# EAGLE design changer (EAGLE 8.4.1)
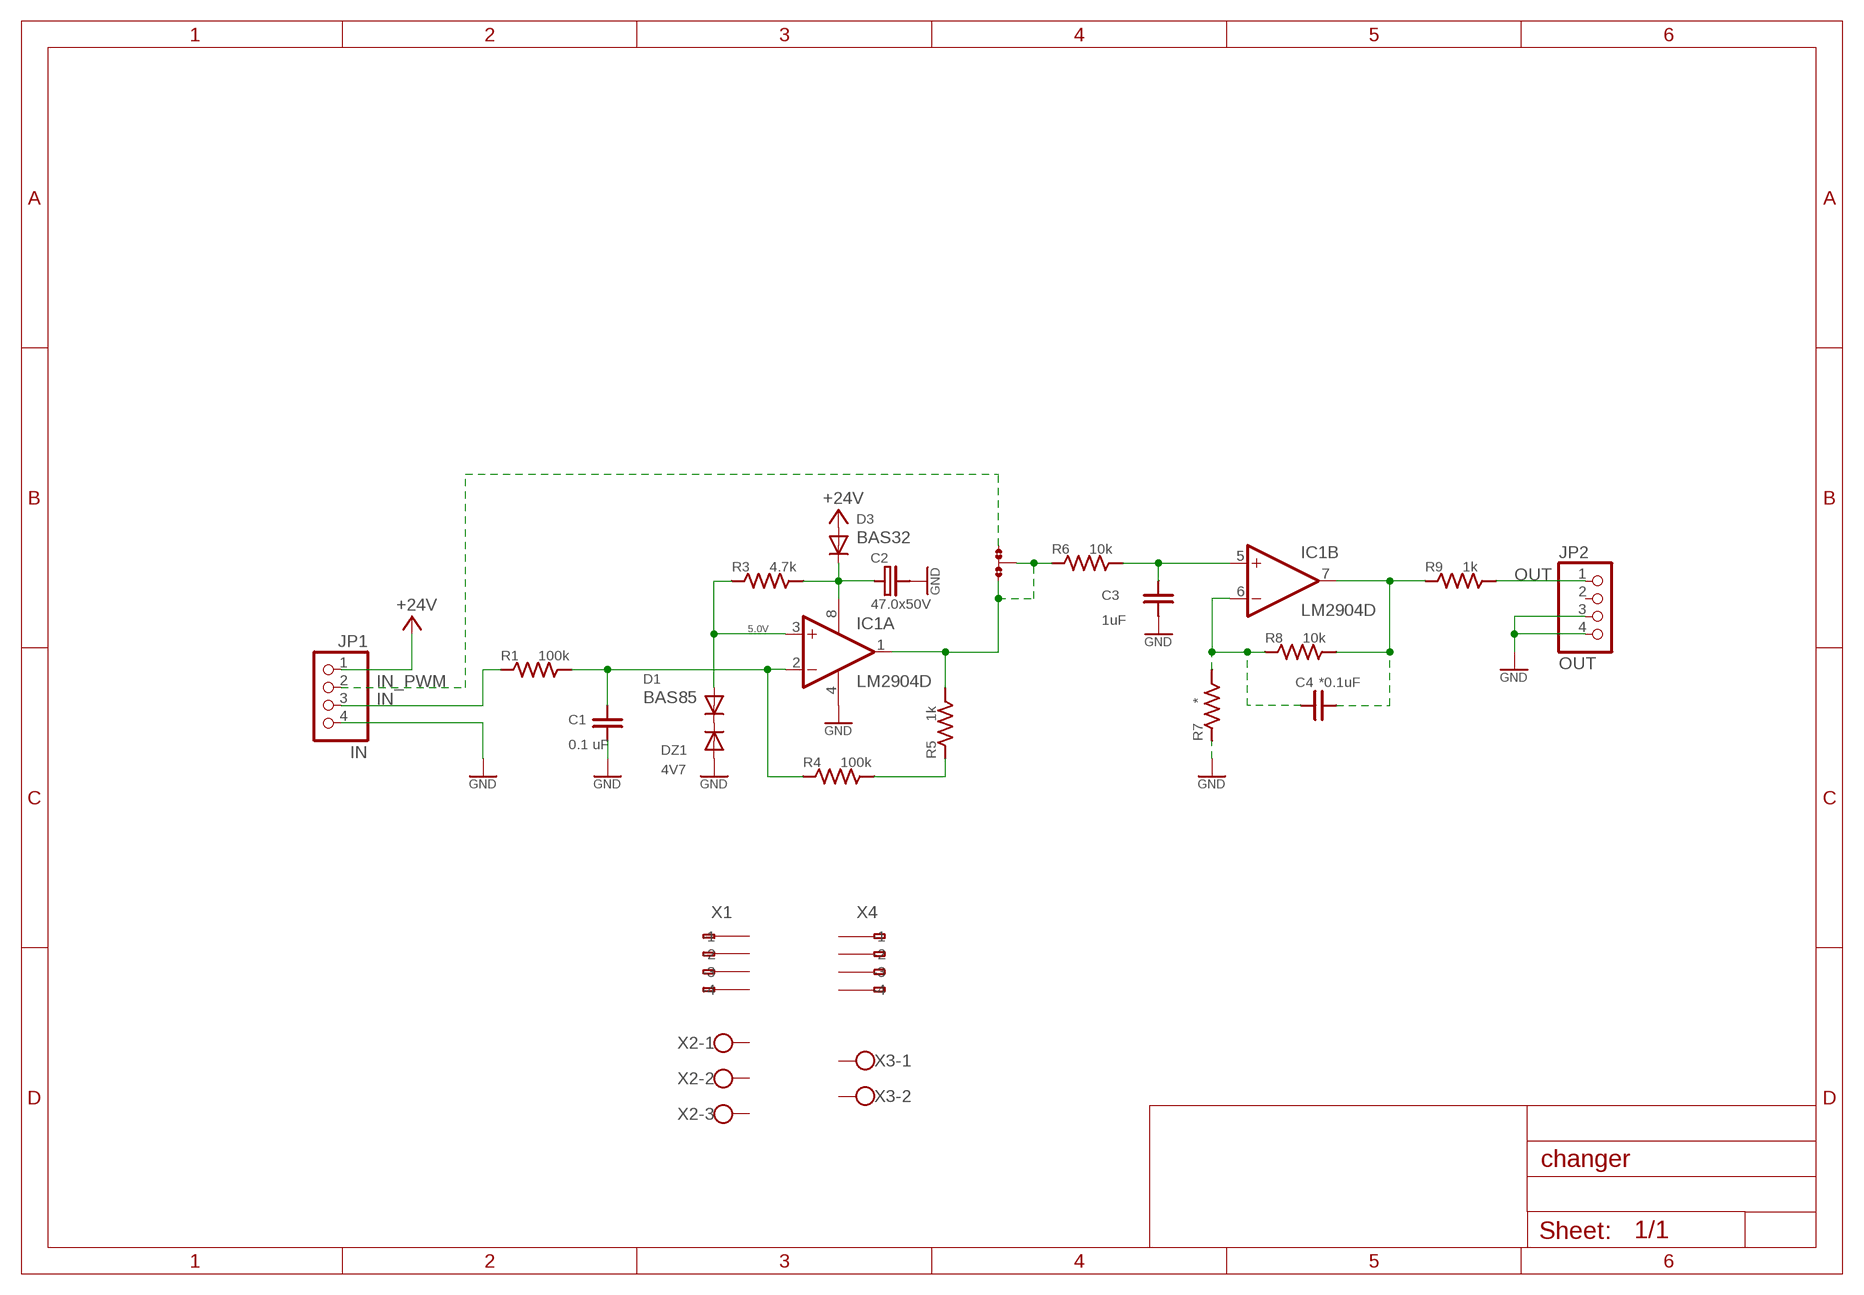
[diagram p0: schematic, sheet 1]

## Parts
C1  0.1 uF  C/0805  [C0805]
C2  47.0x50V  CPOL/E2,5-5  [E2,5-5]
C3  1uF  C/0805  [C0805]
C4  *0.1uF  C/0805  [C0805]
D1  BAS85  DIODE-MINIMELF  [MINIMELF]
D3  BAS32  DIODE-MINIMELF  [MINIMELF]
DZ1  4V7  DIODE-MINIMELF  [MINIMELF]
IC1  LM2904D  LM2903D  [SO08]
JMP1  JUMP  0R-JUMPA  [A0R-JMP]
JP1  IN  PINHD-1X4  [1X04]
JP2  OUT  PINHD-1X4  [1X04]
R1  100k  R/0805  [R0805]
R3  4.7k  R/0805  [R0805]
R4  100k  R/0805  [R0805]
R5  1k  R/0805  [R0805]
R6  10k  R/0805  [R0805]
R7  *  R/0805  [R0805]
R8  10k  R/0805  [R0805]
R9  1k  R/0805  [R0805]
X1  233-104  [233-104]
X2  W237-103  [W237-103]
X3  W237-102  [W237-102]
X4  233-104  [233-104]

## Nets
+24V [power]: D3.A JP1.1
GND: C1.1 C2.- C3.1 DZ1.A IC1.4(P:V-) JP1.4 JP2.3 JP2.4 R7.1
IN: JP1.3 R1.1
IN_PWM: JMP1.1 JP1.2
N$1: D1.C DZ1.C
N$2: D1.A IC1.3(A:+IN) R3.1
N$3: C1.2 IC1.2(A:-IN) R1.2 R4.1
N$4: C3.2 IC1.5(B:+IN) R6.2
N$5: R4.2 R5.1
N$6: C4.2 IC1.7(B:OUT) R8.2 R9.1
N$8: C4.1 IC1.6(B:-IN) R7.2 R8.1
N$10 [power]: C2.+ D3.C IC1.8(P:V+) R3.2
N$11: IC1.1(A:OUT) JMP1.2 JMP1.3 R5.2 R6.1
OUT: JP2.1 R9.2
Unconnected: JP2.2 X1.A1(-1) X1.A2(-2) X1.A3(-3) X1.A4(-4) X1.B1(B-1) X1.B2(B-2) X1.B3(B-3) X1.B4(B-4) X2.1 X2.2 X2.3 X3.1 X3.2 X4.A1(-1) X4.A2(-2) X4.A3(-3) X4.A4(-4) X4.B1(B-1) X4.B2(B-2) X4.B3(B-3) X4.B4(B-4)

## Notes on the sheet
- 5.0V

## Library data of the parts
C1 C3 C4 = descreet:C
C2 = descreet:CPOL
D1 D3 DZ1 = diode:DIODE-: DIODE
IC1 = linear:LM2903: COMPARATOR
JMP1 = jump-0r-smd:0R-JUMP: SMD 0R 0805 Jumper
JP1 JP2 = pinhead:PINHD-1X4: PIN HEADER
R1 R3-R9 = descreet:R
X1 X4 = con-wago:233-104: WAGO Cage Clamp
X2 = con-wago-500:W237-103: WAGO SCREW CLAMP
X3 = con-wago-500:W237-102: WAGO SCREW CLAMP

## Net classes
1 power: clearance 0.356 mm

## Board
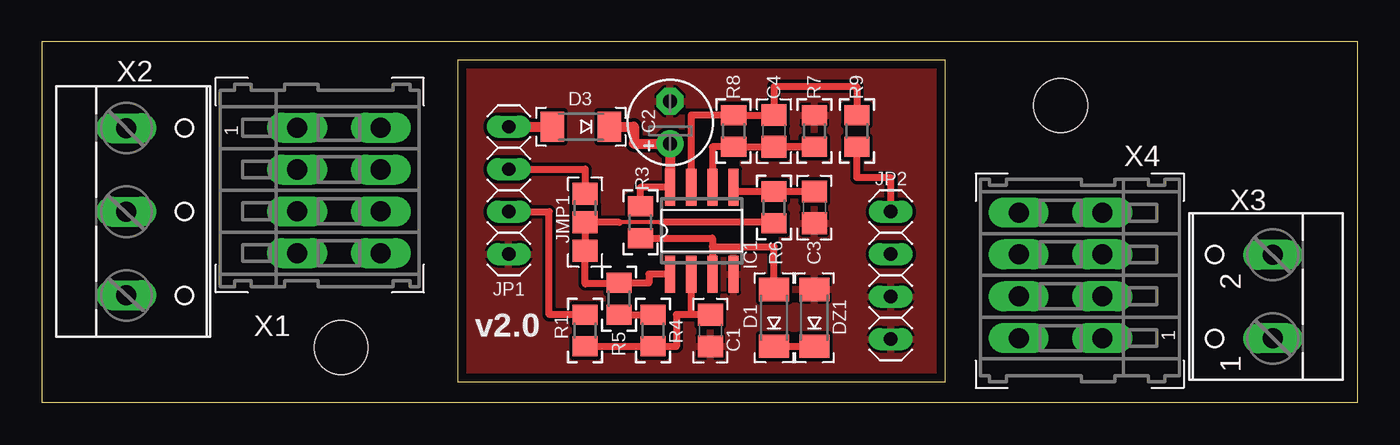
[diagram p1: board, top side]

Size 78.74 x 21.59 mm. Coordinates in mm from the lower left corner, seen from the top.
Outline: 24.89,1.27 54.08,1.27 54.08,20.5 24.89,20.5 24.89,1.27
Outline: 78.74,0 78.74,21.59 0,21.59 0,0 78.74,0
Copper layers (1*16): Top 0.035mm / dielectric 1.5mm / Bottom 0.035mm
Design rules "default *": minimum track width 10mil, minimum drill 24mil, track to track 8mil, track to pad 8mil, pad to pad 8mil, via to via 8mil, smd to smd 8mil, copper to edge 20mil, drill to drill 8mil, minimum pad ring 10mil, minimum via ring 8mil, stop-mask expansion 4mil, vias tented up to drill 0mil, thermal gap 6mil
Holes 3.2 mm at 17.91,3.3 60.96,17.78

### Footprints (pad centres in the part's own frame; a part is rotated, then mirrored left to right if it is on the bottom)
C0805 = smd 1.3 x 1.5: 1 -0.95,0; 2 0.95,0
E2,5-5 = drill 0.813 pad 1.6: + -1.27,0 | drill 0.813 pad 1.6 octagon: - 1.27,0
MINIMELF = smd 1.4 x 1.8: A 1.7,0; C -1.7,0
SO08 = smd 0.6 x 2.2: 1 -1.905,-2.6; 2 -0.635,-2.6; 3 0.635,-2.6; 4 1.905,-2.6; 5 1.905,2.6; 6 0.635,2.6; 7 -0.635,2.6; 8 -1.905,2.6
A0R-JMP = smd 1.5 x 1.3: 1 0,1.7; 2 0,0; 3 0,-1.7
1X04 = drill 0.8 long: 1 -3.81,0; 2 -1.27,0; 3 1.27,0; 4 3.81,0
R0805 = smd 1.2 x 1.5: 1 -0.95,0; 2 0.95,0
233-104 = drill 1.2 long: A1 -3.75,2.5; A2 -1.25,2.5; A3 1.25,2.5; A4 3.75,2.5; B1 -3.75,-2.5; B2 -1.25,-2.5; B3 1.25,-2.5; B4 3.75,-2.5
W237-103 = drill 1.194 long: 1 -5,-1.29; 2 0,-1.29; 3 5,-1.29
W237-102 = drill 1.194 long: 1 -2.5,-1.27; 2 2.5,-1.27

### Placement (x,y rotation side)
C1  40,4.32 90 top
C2  37.59,16.76 90 top
C3  46.23,11.68 90 top
C4  43.81,16.26 90 top
D1  43.81,5.08 90 top
D3  32.26,16.51 180 top
DZ1  46.23,5.08 90 top
IC1  39.5,10.29 0 top
JMP1  32.51,10.79 0 top
JP1  27.94,12.7 270 top
JP2  50.8,7.62 270 top
R1  32.51,4.32 270 top
R3  35.81,10.79 90 top
R4  36.58,4.32 90 top
R5  34.54,6.22 90 top
R6  43.81,11.68 90 top
R7  46.23,16.26 270 top
R8  41.4,16.26 90 top
R9  48.77,16.26 270 top
X1  17.78,12.7 270 top
X2  6.35,11.43 270 top
X3  72.39,6.35 90 top
X4  60.96,7.62 90 top

### Tracks (layer width: path | path; a pad name or v marks a point on that pad's centre or on a via)
+24V
  Top 0.61: JP1.1 D3.A
GND
  pour Top: 24.89,20.45 54.1,20.45 54.1,1.27 24.89,1.27
IN
  Top 0.406: JP1.3 30.35,11.43 30.35,5.27 R1.1
IN_PWM
  Top 0.406: JP1.2 32.51,13.97 JMP1.1
N$1
  Top 0.406: D1.C DZ1.C
N$2
  Top 0.406: 40.13,9.34 IC1.3 | R3.1 40.13,9.84 40.13,9.34 | D1.A 43.81,9.34 40.13,9.34
N$3
  Top 0.406: R1.2 R4.1 37.97,3.37 37.97,5.27 38.86,5.27 | 38.86,5.27 IC1.2 | C1.2 38.86,5.27
N$4
  Top 0.406: C3.2 R6.2 41.4,12.63 IC1.5
N$5
  Top 0.406: R5.1 R4.2
N$6
  Top 0.406: IC1.7 38.86,17.21 R8.2 C4.2 43.81,18.92 48.77,18.92 R9.1
N$8
  Top 0.406: IC1.6 40.13,15.31 R8.1 C4.1 46.1,15.31 44.07,15.3 R7.2
N$10
  Top 0.406: R3.2 35.81,12.89 IC1.8
  Top 0.61: IC1.8 C2.+ 35.43,15.49 35.43,16.51 D3.C
N$11
  Top 0.254: 37.08,10.79 34.54,10.79
  Top 0.406: IC1.1 36.32,7.69 36.32,7.17 R5.2 34.54,7.11 32.51,7.11 JMP1.3 JMP1.2 34.54,10.79 | R6.1 43.81,10.79 37.08,10.79
OUT
  Top 0.406: JP2.1 50.8,13.46 48.77,13.46 R9.2 48.77,15.24

### Text on the board
tPlace: v2.0
tValues: 1 | 2 | 3 | 1 | 4 | 2 | 3 | 4